# EAGLE design Papra v0.6 (EAGLE 9.6.2)
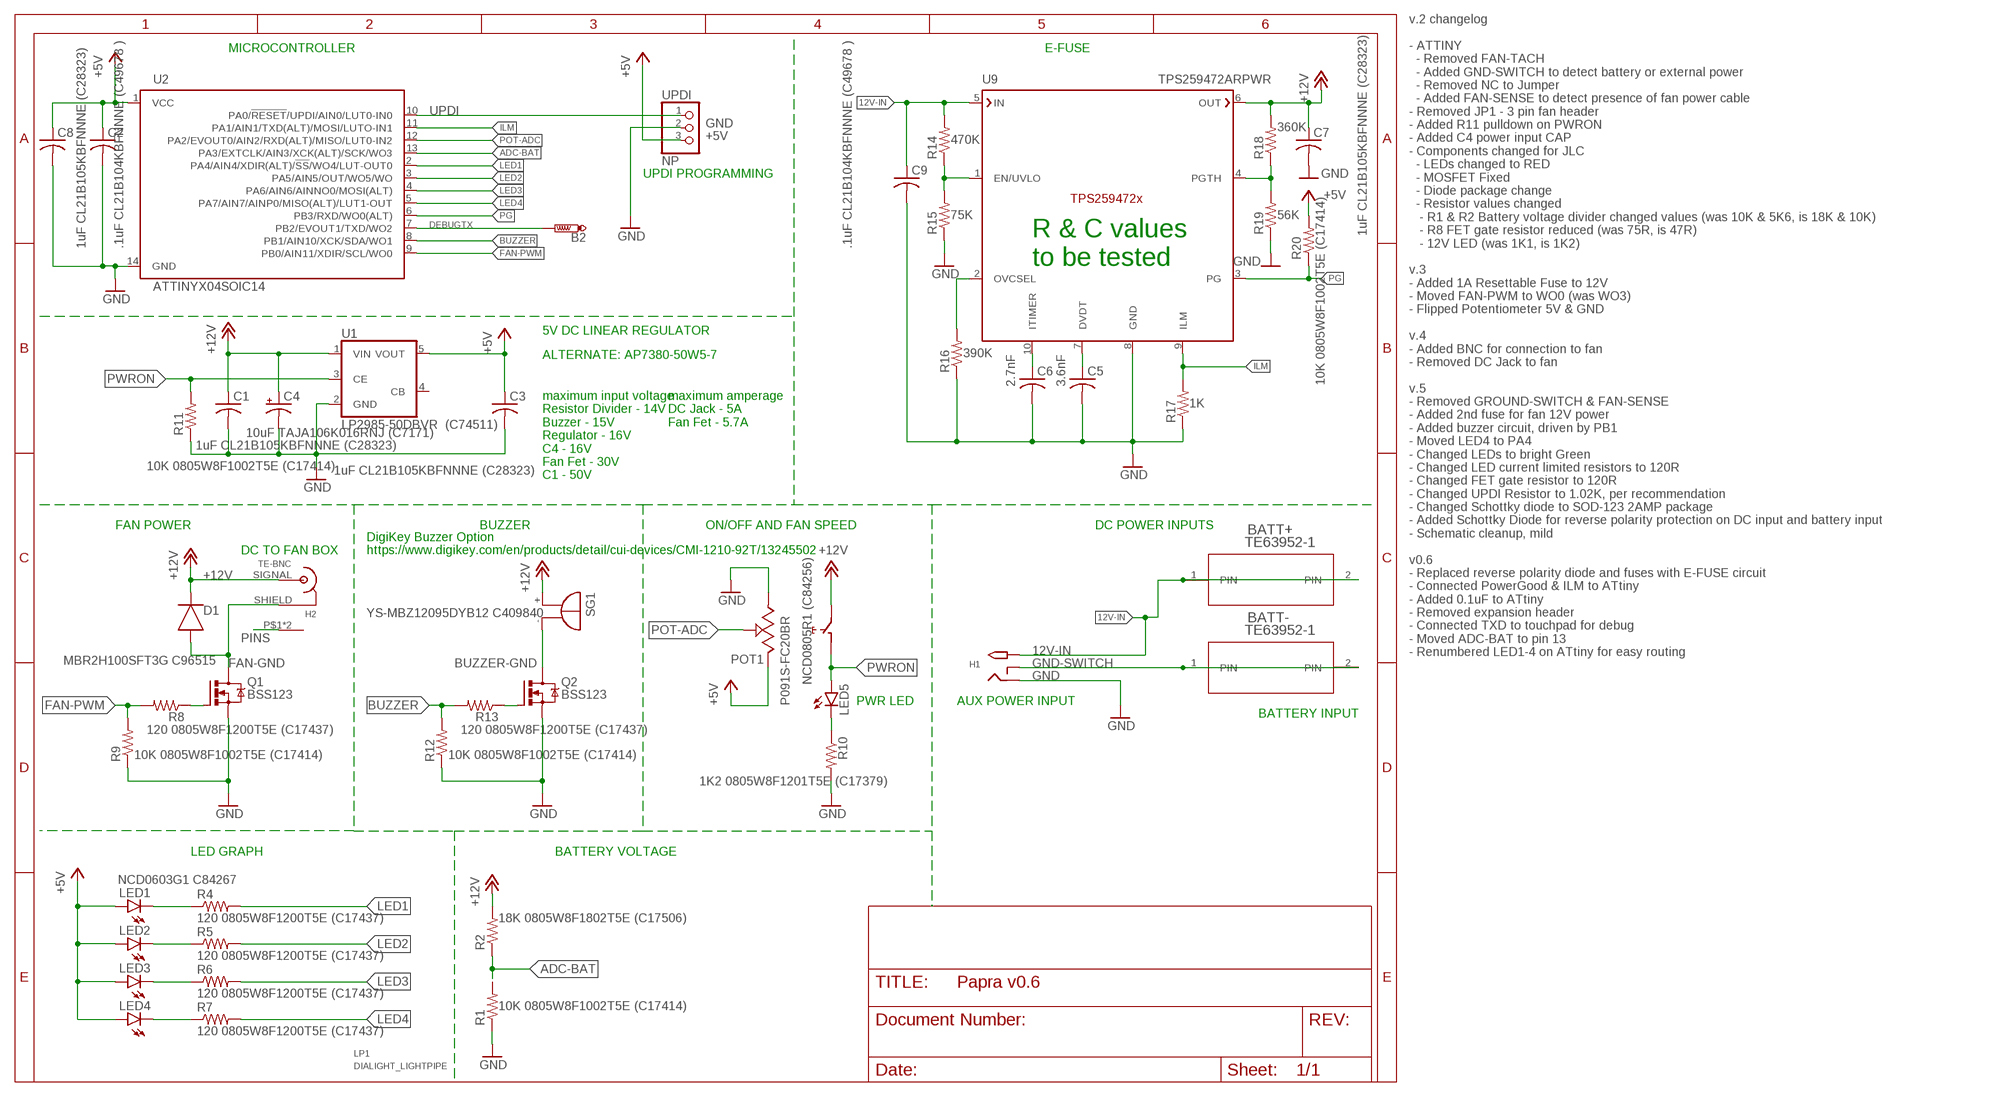
[diagram p0: schematic, sheet 1]

## Parts
B2  PTR1PAD1-13  [P1-13]
BATT+  TE63952-1  [TE63952-1]
BATT-  TE63952-1  [TE63952-1]
C1  1uF CL21B105KBFNNNE (C28323)  C-USC0805  [C0805]
C2  .1uF CL21B104KBFNNNE (C49678 )  C-USC0805  [C0805]
C3  1uF CL21B105KBFNNNE (C28323)  C-USC0805  [C0805]
C4  10uF TAJA106K016RNJ (C7171)  CPOL-USA/3216-18R  [A/3216-18R]
C5  3.6nF  C-USC0805  [C0805]
C6  2.7nF  C-USC0805  [C0805]
C7  1uF CL21B105KBFNNNE (C28323)  C-USC0805  [C0805]
C8  1uF CL21B105KBFNNNE (C28323)  C-USC0805  [C0805]
C9  .1uF CL21B104KBFNNNE (C49678 )  C-USC0805  [C0805]
D1  MBR2H100SFT3G C96515  DIODE_DO-219-AB(SOD123F)  [SODFL3718X115]
H1  M-CUI-PJ-066A  PJ-066A  [DCJACK-PJ-066A]
H2  TE-BNC  [TE-BNC]
LED1  NCD0603G1 C84267  LEDCHIPLED_0805  [CHIPLED_0805]
LED2  NCD0603G1 C84267  LEDCHIPLED_0805  [CHIPLED_0805]
LED3  NCD0603G1 C84267  LEDCHIPLED_0805  [CHIPLED_0805]
LED4  NCD0603G1 C84267  LEDCHIPLED_0805  [CHIPLED_0805]
LED5  NCD0805R1 (C84256)  LEDCHIPLED_0805  [CHIPLED_0805]
LP1  DIALIGHT_LIGHTPIPE  [DIALIGHT_5151020F_/LEDS]
POT1  P091S-FC20BR  [P091S-FC20BR]
Q1  BSS123  NMOSFET_BSS123-SOT23  [SOT23]
Q2  BSS123  NMOSFET_BSS123-SOT23  [SOT23]
R1  10K 0805W8F1002T5E (C17414)  R-US_R0805  [R0805]
R2  18K 0805W8F1802T5E (C17506)  R-US_R0805  [R0805]
R4  120 0805W8F1200T5E (C17437)  R-US_R0805  [R0805]
R5  120 0805W8F1200T5E (C17437)  R-US_R0805  [R0805]
R6  120 0805W8F1200T5E (C17437)  R-US_R0805  [R0805]
R7  120 0805W8F1200T5E (C17437)  R-US_R0805  [R0805]
R8  120 0805W8F1200T5E (C17437)  R-US_R0805  [R0805]
R9  10K 0805W8F1002T5E (C17414)  R-US_R0805  [R0805]
R10  1K2 0805W8F1201T5E (C17379)  R-US_R0805  [R0805]
R11  10K 0805W8F1002T5E (C17414)  R-US_R0805  [R0805]
R12  10K 0805W8F1002T5E (C17414)  R-US_R0805  [R0805]
R13  120 0805W8F1200T5E (C17437)  R-US_R0805  [R0805]
R14  470K  R-US_R0805  [R0805]
R15  75K  R-US_R0805  [R0805]
R16  390K  R-US_R0805  [R0805]
R17  1K  R-US_R0805  [R0805]
R18  360K  R-US_R0805  [R0805]
R19  56K  R-US_R0805  [R0805]
R20  10K 0805W8F1002T5E (C17414)  R-US_R0805  [R0805]
SG1  YS-MBZ12095DYB12 C409840  F/TMB  [F/TMB]
U1  LP2985-50DBVR (C74511)  TS520533  [SOT25]
U2  ATTINYX04SOIC14  [SOIC127P600X144-14]
U9  TPS259472ARPWR  [QFN45P200X200X100-16N]
UPDI  NP  PINHD-1X3  [1X03]

## Nets
12V-IN [RAIL]: BATT+.1(PIN) BATT+.2(PIN) C9.1 H1.PWR(TIP) R14.2 U9.5(IN)
+5V [RAIL]: C2.1 C3.1 C8.1 LED1.A LED2.A LED3.A LED4.A POT1.3 R20.2 U1.5(VOUT) U2.1(VCC) UPDI.3
+12V [RAIL]: C1.1 C4.+ C7.1 D1.1(C) H2.SIGNAL(P1) POT1.NO R2.2 R18.2 SG1.+ U1.1(VIN) U9.6(OUT)
ADC-BAT: R1.2 R2.1 U2.13(PA3/EXTCLK/AIN3/XCK(ALT)/SCK/WO3)
BUZZER: R12.2 R13.2 U2.8(PB1/AIN10/XCK/SDA/WO1)
BUZZER-GND [RAIL]: Q2.3(D) SG1.-
DEBUGTX: B2.TP U2.7(PB2/EVOUT1/TXD/WO2)
DVDT: C5.1 U9.7(DVDT)
EN/UVLO: R14.1 R15.2 U9.1(EN/UVLO)
FAN-GND [RAIL]: D1.2(A) H2.SHIELD(P2) Q1.3(D)
FAN-PWM: R8.2 R9.2 U2.9(PB0/AIN11/XDIR/SCL/WO0)
FETGATE: Q1.1(G) R8.1
FETGATE1: Q2.1(G) R13.1
GND: C1.2 C2.2 C3.2 C4.- C5.2 C6.2 C7.2 C8.2 C9.2 H1.GND(RING) POT1.1 Q1.2(S) Q2.2(S) R1.1 R9.1 R10.2 R11.1 R12.1 R15.1 R16.1 R17.1 R19.1 U1.2(GND) U2.14(GND) U9.8(GND) UPDI.2
GND-SWITCH: BATT-.1(PIN) BATT-.2(PIN) H1.GNDBREAK(RING_SW)
ILM: R17.2 U2.11(PA1/AIN1/TXD(ALT)/MOSI/LUTO-IN1) U9.9(ILM)
ITIMER: C6.1 U9.10(ITIMER)
LED1: R4.2 U2.2(PA4/AIN4/XDIR(ALT)/!SS!/WO4/LUT-OUT0)
LED1-R: LED1.C R4.1
LED2: R5.2 U2.3(PA5/AIN5/OUT/WO5/WO)
LED2-R: LED2.C R5.1
LED3: R6.2 U2.4(PA6/AIN6/AINNO0/MOSI(ALT))
LED3-R: LED3.C R6.1
LED4: R7.2 U2.5(PA7/AIN7/AINP0/MISO(ALT)/LUT1-OUT)
LED4-R: LED4.C R7.1
LED5-R: LED5.C R10.1
OVCSEL: R16.2 U9.2(OVCSEL)
PG: R20.1 U2.6(PB3/RXD/WO0(ALT)) U9.3(PG)
PGTH: R18.1 R19.2 U9.4(PGTH)
PINS: H2.P$1(P3) H2.P$2(P3)
POT-ADC: POT1.2 U2.12(PA2/EVOUT0/AIN2/RXD(ALT)/MISO/LUT0-IN2)
PWRON: LED5.A POT1.COM R11.2 U1.3(CE)
UPDI: U2.10(PA0/!RESET!/UPDI/AIN0/LUT0-IN0) UPDI.1
Unconnected: U1.4(CB)

## Notes on the sheet
- v.2 changelog
  
  - ATTINY 
    - Removed FAN-TACH
    - Added GND-SWITCH to detect battery or external power
    - Removed NC to Jumper
    - Added FAN-SENSE to detect presence of fan power cable
  - Removed JP1 - 3 pin fan header
  - Added R11 pulldown on PWRON
  - Added C4 power input CAP 
  - Components changed for JLC
    - LEDs changed to RED
    - MOSFET Fixed
    - Diode package change
    - Resistor values changed
     - R1 & R2 Battery voltage divider changed values (was 10K & 5K6, is 18K & 10K)
     - R8 FET gate resistor reduced (was 75R, is 47R)
     - 12V LED (was 1K1, is 1K2)
  
  v.3
  - Added 1A Resettable Fuse to 12V
  - Moved FAN-PWM to WO0 (was WO3)
  - Flipped Potentiometer 5V & GND
  
  v.4 
  - Added BNC for connection to fan
  - Removed DC Jack to fan
  
  v.5
  - Removed GROUND-SWITCH & FAN-SENSE
  - Added 2nd fuse for fan 12V power
  - Added buzzer circuit, driven by PB1
  - Moved LED4 to PA4
  - Changed LEDs to bright Green
  - Changed LED current limited resistors to 120R
  - Changed FET gate resistor to 120R
  - Changed UPDI Resistor to 1.02K, per recommendation
  - Changed Schottky diode to SOD-123 2AMP package
  - Added Schottky Diode for reverse polarity protection on DC input and battery input
  - Schematic cleanup, mild
  
  v0.6
  - Replaced reverse polarity diode and fuses with E-FUSE circuit
  - Connected PowerGood & ILM to ATtiny
  - Added 0.1uF to ATtiny
  - Removed expansion header
  - Connected TXD to touchpad for debug
  - Moved ADC-BAT to pin 13
  - Renumbered LED1-4 on ATtiny for easy routing
- MICROCONTROLLER | E-FUSE
- UPDI PROGRAMMING
- R & C values
  to be tested
- 5V DC LINEAR REGULATOR
- ALTERNATE: AP7380-50W5-7
- maximum input voltage
  Resistor Divider - 14V
  Buzzer - 15V
  Regulator - 16V
  C4 - 16V
  Fan Fet - 30V
  C1 - 50V
- maximum amperage
  DC Jack - 5A
  Fan Fet - 5.7A
- FAN POWER | BUZZER | ON/OFF AND FAN SPEED | DC POWER INPUTS
- DC TO FAN BOX
- DigiKey Buzzer Option
  https://www.digikey.com/en/products/detail/cui-devices/CMI-1210-92T/13245502
- PWR LED | AUX POWER INPUT
- BATTERY INPUT
- LED GRAPH | BATTERY VOLTAGE

## Library data of the parts
B2 = testpad:PTR1: TEST PIN
BATT+ BATT- = PC-LIB:TE63952-1
C1-C3 C5-C9 = rcl:C-US: CAPACITOR, American symbol; SPICEPREFIX: C
C4 = rcl:CPOL-US: POLARIZED CAPACITOR, American symbol; SPICEPREFIX: C
D1 = Diode:DIODE: Diode Rectifier - Generic; CATEGORY: Diode; SUB-CATEGORY: Rectifier; VALUE: DIODE
H1 = PC-LIB:PJ-066A
H2 = PC-LIB:TE-BNC: https://www.te.com/usa-en/product-1-1478032-0.html
LED1-LED5 = led:LED: LED OSRAM: - CHIPLED LG R971, LG N971, LY N971, LG Q971, LY Q971, LO R971, LY R971 LH N974, LH R974 LS Q976, LO Q976, LY Q976 LO Q996 - Hyper CHIPLED LW Q18S LB Q993, LB Q99A, LB R99A - SideLED LS A670, LO A670, LY A670, LG A670, LP A670 LB A673, LV A673, LT A673, LW A673 LH A674 LY A675 LS A676, LA A676, LO A676, LY A676, LW A676 LS A679, LY A679, LG A679 - Hyper Micro SIDELED® LS Y876, LA Y876, LO Y876, LY Y876 LT Y87S - SmartLED LW L88C, LW L88S LB L89C, LB L89S, LG L890 LS L89K, LO L89K, LY L89K LS L896, LA L896, LO L896, LY L896 - TOPLED LS T670, LO T670, LY T670, LG T670, LP T670 LSG T670, LSP T670, LSY T670, LOP T670, LYG T670 LG T671, LOG T671, LSG T671 LB T673, LV T673, LT T673, LW T673 LH T674 LS T676, LA T676, LO T676, LY T676, LB T676, LH T676, LSB T676, LW T676 LB T67C, LV T67C, LT T67C, LS T67K, LO T67K, LY T67K, LW E67C LS E67B, LA E67B, LO E67B, LY E67B, LB E67C, LV E67C, LT E67C LW T67C LS T679, LY T679, LG T679 LS T770, LO T770, LY T770, LG T770, LP T770 LB T773, LV T773, LT T773, LW T773 LH T774 LS E675, LA E675, LY E675, LS T675 LS T776, LA T776, LO T776, LY T776, LB T776 LHGB T686 LT T68C, LB T68C - Hyper Mini TOPLED® LB M676 - Mini TOPLED Santana® LG M470 LS M47K, LO M47K, LY M47K Source: http://www.osram.convergy.de LUXEON: - LUMILED® LXK2-PW12-R00, LXK2-PW12-S00, LXK2-PW14-U00, LXK2-PW14-V00 LXK2-PM12-R00, LXK2-PM12-S00, LXK2-PM14-U00 LXK2-PE12-Q00, LXK2-PE12-R00, LXK2-PE12-S00, LXK2-PE14-T00, LXK2-PE14-U00 LXK2-PB12-K00, LXK2-PB12-L00, LXK2-PB12-M00, LXK2-PB14-N00, LXK2-PB14-P00, LXK2-PB14-Q00 LXK2-PR12-L00, LXK2-PR12-M00, LXK2-PR14-Q00, LXK2-PR14-R00 LXK2-PD12-Q00, LXK2-PD12-R00, LXK2-PD12-S00 LXK2-PH12-R00, LXK2-PH12-S00 LXK2-PL12-P00, LXK2-PL12-Q00, LXK2-PL12-R00 Source: www.luxeon.com KINGBRIGHT: KA-3528ASYC Source: www.kingbright.com
LP1 = PC-LIB:DIALIGHT_LIGHTPIPE: DIALIGHT QUAD LIGHTPIPE 515-1020 WITH 0805LEDS
POT1 = PC-LIB:P091S-FC20BR: TT P091S-FC20BR10K
Q1 Q2 = Transistor:NMOSFET_: N-Channel MOSFET - Popular parts; CATEGORY: Transistor; DESCRIPTION: MOSFET N-CH 100V 0.17A SOT-23; DRAIN_CURRENT: 170mA; MANUFACTURER: ON Semiconductor; MPN: BSS123L; OPERATING_TEMP: -55°C ~ 150°C; PART_STATUS: Active; ROHS_COMPLIANT: Yes; SUB-CATEGORY: MOSFET; THERMALLOSS: 360mW; TYPE: N-Channel
R1 R2 R4-R20 = rcl:R-US_: RESISTOR, American symbol; SPICEPREFIX: R
SG1 = buzzer:F/TMB: BUZZER Source: Buerklin; OC_FARNELL: unknown; OC_NEWARK: unknown
U1 = v-reg:TS5205: 150mA Low Noise LDO Voltage Regulator with Enable TSC [Taiwan Semiconductor Company, Ltd] Source: http://www.taiwansemi.com .. 5205_0409c.pdf
U2 = PC-LIB:ATTINYX04
U9 = TI e-Fuse:TPS259472ARPWR
UPDI = adafruit:PINHD-1X3: PIN HEADER

## Net classes
0 default: width 0.152 mm, clearance 0.152 mm
1 RAIL: width 0.229 mm, clearance 0.152 mm

## Board
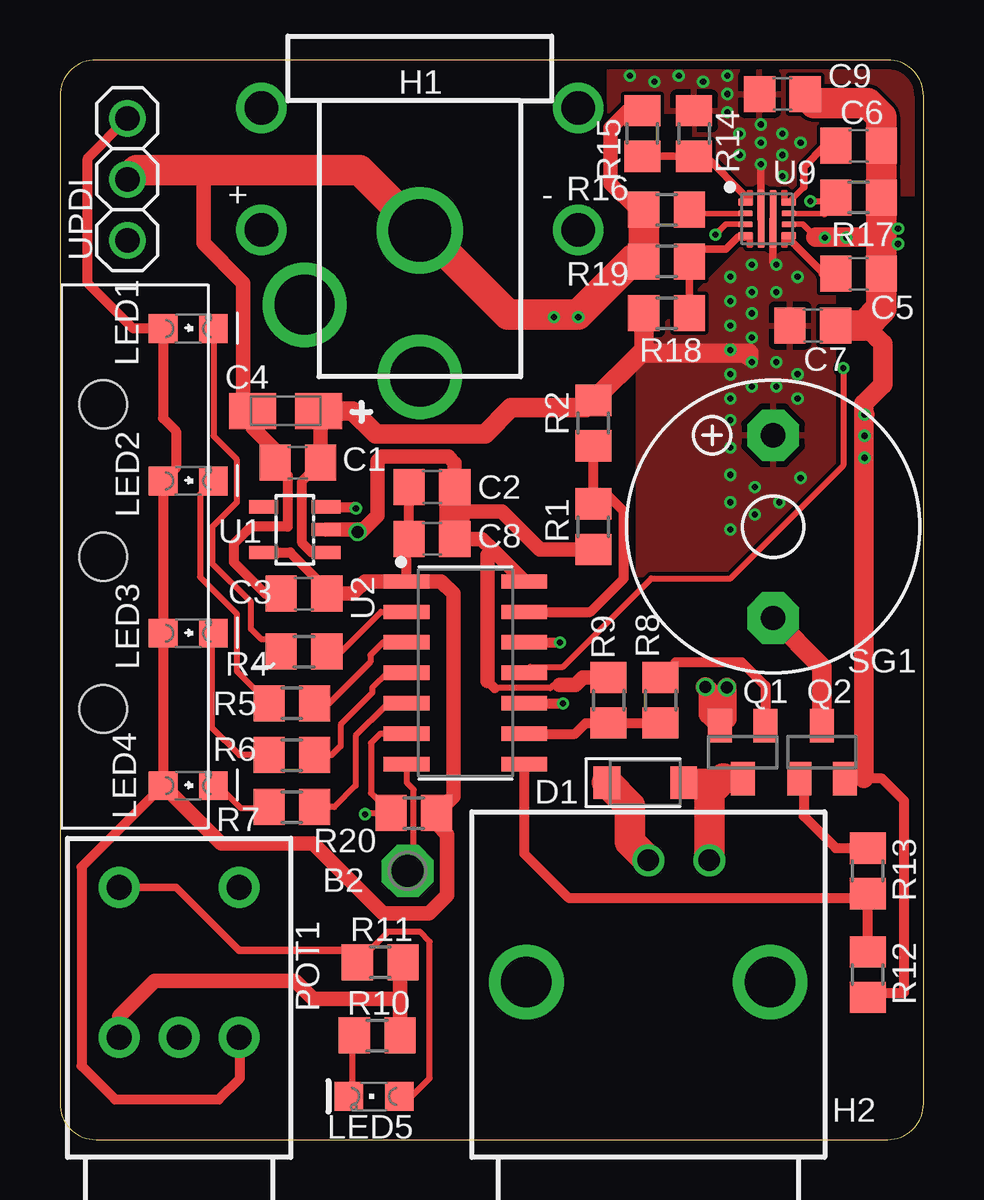
[diagram p1: board, top side]
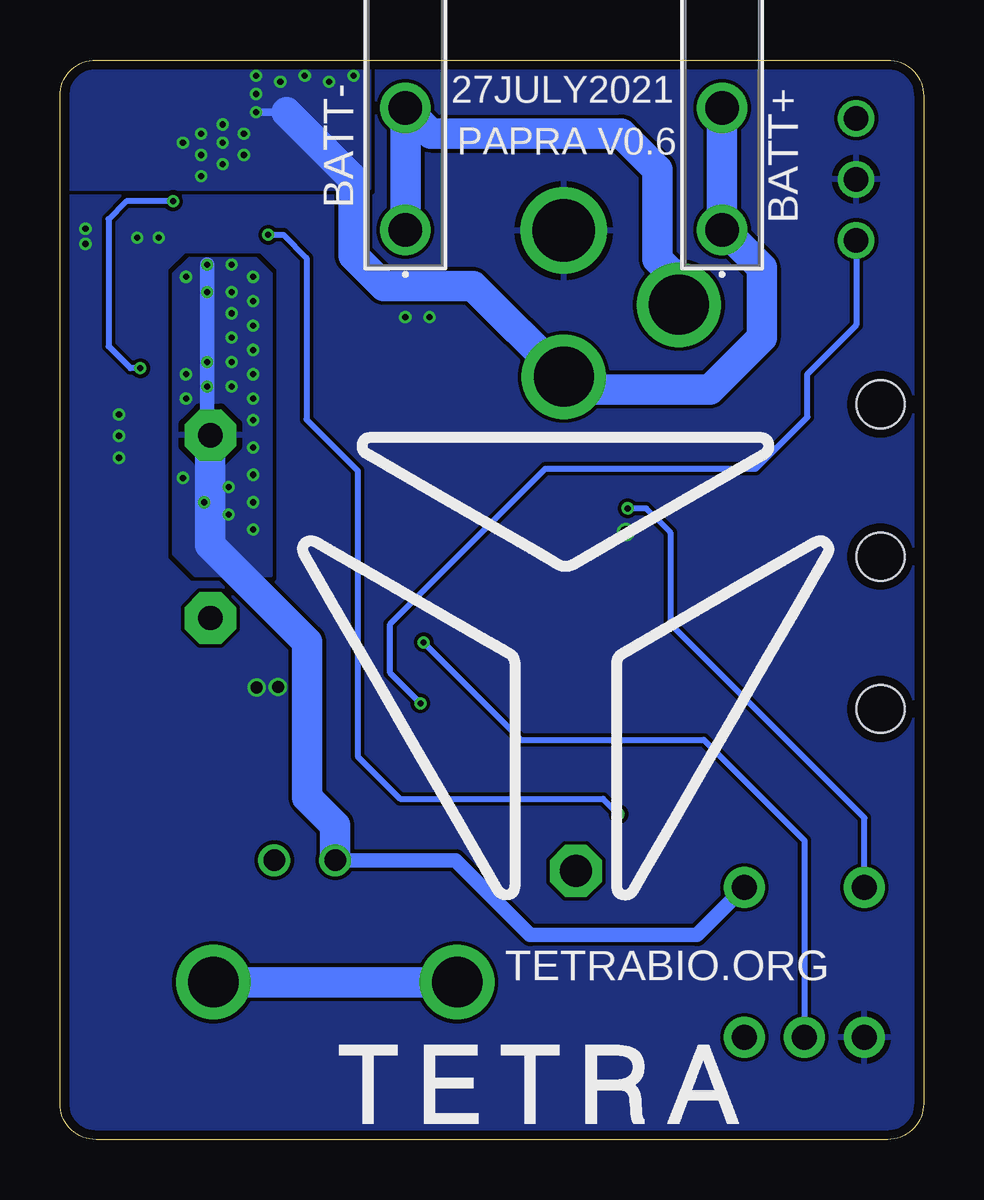
[diagram p2: board, bottom side, seen from below]

Size 36 x 45 mm. Coordinates in mm from the lower left corner, seen from the top.
Outline: 34.5,45 1.5,45 arc90 0,43.5 0,1.5 arc90 1.5,0 34.5,0 arc90 36,1.5 36,43.5 arc90 34.5,45
Copper layers (1*16): Top 0.035559375mm / dielectric 1.6mm / Bottom 0.035559375mm
Design rules "oshpark-2layer": minimum track width 6mil, minimum drill 10mil, track to track 6mil, track to pad 6mil, pad to pad 6mil, via to via 6mil, smd to smd 6mil, copper to edge 15mil, drill to drill 6mil, minimum pad ring 5mil, minimum via ring 5mil, stop-mask expansion 2.5mil, vias tented up to drill 0mil, thermal gap 10mil

### Footprints (pad centres in the part's own frame; a part is rotated, then mirrored left to right if it is on the bottom)
P1-13 = drill 1.321 pad 2.159 octagon: TP 0,0
TE63952-1 = drill 1.397 pad 1.905: 1 -2.54,0; 2 2.54,0
C0805 = smd 1.3 x 1.5: 1 -0.95,0; 2 0.95,0
A/3216-18R = smd 1.95 x 1.5: + 1.375,0; - -1.375,0
SODFL3718X115 = smd 1.115 x 1.361: 1 -1.6,0; 2 1.6,0
DCJACK-PJ-066A = drill 2.6: GND 0,8.1 | drill 2.5: GNDBREAK 4.8,11.2; PWR 0,14.2
TE-BNC = drill 2.1: P$1 -7.3,5.08; P$2 -7.3,-5.08 | drill 0.89: SHIELD -12.38,2.54; SIGNAL -12.38,0
CHIPLED_0805 = smd 1.2 x 1.2: A 0,-1.05; C 0,1.05
DIALIGHT_5151020F_/LEDS = hole 2: 0,0; 6.35,0; -6.35,0
P091S-FC20BR = drill 1.05 pad 1.7: 1 -5,-2.5; 2 -5,0; 3 -5,2.5; COM -11.25,-2.5; NO -11.25,2.5
SOT23 = smd 1 x 1.4: 1 -0.95,-1.1; 2 0.95,-1.1; 3 0,1.1
R0805 = smd 1.3 x 1.5: 1 -0.95,0; 2 0.95,0
F/TMB = drill 1.016 pad 2.159 octagon: + 3.81,0; - -3.81,0
SOT25 = smd 0.55 x 1.2: 1 -0.95,-1.3; 2 0,-1.3; 3 0.95,-1.3; 4 0.95,1.3; 5 -0.95,1.3
SOIC127P600X144-14 = smd 1.901 x 0.599: 1 -2.455,3.81; 2 -2.455,2.54; 3 -2.455,1.27; 4 -2.455,0; 5 -2.455,-1.27; 6 -2.455,-2.54; 7 -2.455,-3.81; 8 2.455,-3.81; 9 2.455,-2.54; 10 2.455,-1.27; 11 2.455,0; 12 2.455,1.27; 13 2.455,2.54; 14 2.455,3.81
QFN45P200X200X100-16N = smd 0.6 x 0.3: 1 -0.9,0.7; 4 -0.9,-0.7; 7 0.9,-0.7; 10 0.9,0.7 | smd 0.6 x 0.25: 2 -0.9,0.225; 3 -0.9,-0.225; 8 0.9,-0.225; 9 0.9,0.225 | smd 0.3 x 2.4: 5 -0.25,0; 6 0.25,0
1X03 = drill 1.016: 1 -2.54,0; 2 0,0; 3 2.54,0

### Placement (x,y rotation side)
B2  14.49,11.2 0 top
BATT+  8.4,40.46 90 bottom
BATT-  21.6,40.46 90 bottom
C1  9.92,28.21 180 top
C2  15.51,27.2 0 top
C3  10.17,22.75 180 top
C4  9.41,30.37 0 top
C5  33.29,36.09 0 top
C6  33.29,41.42 0 top
C7  31.38,33.93 0 top
C8  15.51,25.04 0 top
C9  30.11,43.58 0 top
D1  24.4,14.88 0 top
H1  15,46 180 top
H2  24.52,-0.74 270 top
LED1  5.35,33.8 270 top
LED2  5.35,27.45 270 top
LED3  5.35,21.1 270 top
LED4  5.35,14.75 270 top
LED5  13.1,1.8 90 top
LP1  1.8,24.3 270 top
POT1  4.97,-0.74 270 top
Q1  28.46,16.15 180 top
Q2  31.76,16.15 0 top
R1  22.24,25.55 90 top
R2  22.24,29.87 90 top
R4  10.17,20.34 0 top
R5  9.67,18.18 0 top
R6  9.67,16.02 0 top
R7  9.67,13.86 0 top
R8  25.03,18.31 270 top
R9  22.87,18.31 270 top
R10  13.22,4.34 0 top
R11  13.35,7.39 180 top
R12  33.67,6.88 90 top
R13  33.67,11.2 270 top
R14  26.43,41.93 90 top
R15  24.27,41.93 270 top
R16  25.29,38.76 0 top
R17  33.29,39.26 180 top
R18  25.29,34.44 180 top
R19  25.29,36.6 0 top
R20  14.75,13.61 0 top
SG1  29.73,25.55 90 top
U1  9.79,25.42 90 top
U2  16.91,19.45 0 top
U9  29.48,38.38 0 top
UPDI  2.81,40.03 90 top

### Tracks (layer width: path | path; a pad name or v marks a point on that pad's centre or on a via)
12V-IN  (via drill 0.25)
  Top 0.229: v29.23,40.66 v29.22,40.66
  Top 0.305: U9.5 v29.23,40.66
  Bottom 0.305: 26.56,42.82 v27.83,42.82
  Bottom 1.27: BATT+.2 BATT+.1 8.32,37.92 6.74,36.34 6.74,33.42 8.9,31.26 15,31.26 H1.PWR 18.79,35.58 22.49,35.58 23.76,36.85 23.76,40.03 26.56,42.82
  other vias: 29.22,41.55 29.22,42.31 28.34,41.04 30.11,41.04 30.11,41.93 28.34,41.93 30.88,41.55 30.11,40.15 27.83,43.58 27.83,44.34 26.81,44.09 25.8,44.34 24.78,44.09 23.76,44.34
  pour Bottom (isolate 0.203, rank 2): 23.13,39.64 36.46,39.64 36.46,45.23 23.13,45.23
  pour Top (isolate 0.152): 22.87,45.23 36.34,45.23 36.34,39.39 26.43,39.39 26.43,42.82 22.87,42.82
+5V
  Top 0.406: U1.5 9.6,24.47 11.12,22.95 C3.1 | U2.1 14.45,24.93 C8.1 C2.1 | POT1.3 7.51,4.22 7.51,2.56 6.62,1.67 2.3,1.67 0.9,3.07 0.9,11.36 LED4.A LED3.A LED2.A 4.84,28 4.84,29.53 4.3,30.07 LED1.A 3.06,33.8 1.16,35.71 1.16,40.91 UPDI.3
  Top 0.61: C3.1 12.21,22.75 12.71,23.26 U2.1 15.89,23.26 16.4,22.75 16.4,14.31 R20.2 15.7,13.17 16.14,12.72 16.14,10.18 15.38,9.42 13.48,9.42 10.55,12.34 6.71,12.34 LED4.A
+12V  (via drill 0.25)
  Top 0.229: 29.73,36.6 v29.86,36.47
  Top 0.305: U9.6 29.73,36.6
  Top 0.406: U1.1 10.49,24.47 10.1,24.86 10.1,27.44 C1.1
  Top 0.61: C4.+ 10.87,30.29 C1.1
  Top 0.813: 24.21,32.79 R2.2 21.92,30.5 18.81,30.5 17.72,29.41 13.17,29.41 12.21,30.37 C4.+ | 24.21,32.79 24.34,32.91 R18.2 | 24.21,32.79 28.72,32.79 28.72,32.66
  Top 1.27: H2.SIGNAL 23.76,12.4 23.76,13.91 D1.1
  Bottom 0.61: POT1.NO 9.45,8.53 16.4,8.53 19.51,11.64 H2.SIGNAL | v29.86,36.47 v29.86,35.33 v29.86,32.41 29.86,29.48 SG1.+
  Bottom 1.27: SG1.+ 29.73,24.79 25.69,20.75 25.69,14.27 24.52,13.1 H2.SIGNAL
  other vias: 28.84,36.47 28.84,35.33 28.84,34.44 28.84,33.42 28.84,32.41 28.84,31.39 27.95,31.9 27.95,32.91 27.95,33.93 27.95,34.95 27.95,35.96 30.75,35.96 27.95,30.88 29.86,31.39 30.75,31.9 30.75,30.88 27.95,29.99 27.95,28.85 27.95,27.71 27.95,26.56 27.95,25.42 28.97,26.06 28.97,27.2 29.99,26.56 30.88,27.58
  pour Top (isolate 0.152): 28.34,37.11 30.49,37.11 32.27,35.33 32.27,23.52 24.07,23.52 24.07,32.84
  pour Bottom (isolate 0.152): 27.19,23.52 30.37,23.52 31.26,24.41 31.26,36.09 30.62,36.72 27.83,36.72 27.19,36.09
ADC-BAT
  Top 0.406: R1.2 22.24,26.82 | 22.24,26.82 R2.1 | U2.13 22.11,21.99 23.51,23.39 23.51,26.18 22.87,26.82 22.24,26.82
BUZZER
  Top 0.406: R12.2 R13.2 33.48,10.05 21.22,10.05 19.36,11.92 U2.8
BUZZER-GND
  Top 0.813: SG1.- 31.76,19.71 Q2.3
DEBUGTX
  Top 0.254: U2.7 14.45,14.88 14.75,14.58 14.75,12.21 14.49,11.96 B2.TP
DVDT
  Top 0.254: U9.7 30.38,37.55
  Top 0.305: 31.84,36.09 30.38,37.55
  Top 0.406: 31.84,36.09 C5.1
EN/UVLO
  Top 0.254: U9.1 28.58,39.33
  Top 0.305: 28.58,39.33 26.93,40.98 R14.1 R15.2
FAN-GND
  Top 0.813: D1.2 26.17,15.05 27.65,15.05 Q1.3
  Top 1.27: H2.SHIELD 27.06,14.47 27.65,15.05
FAN-PWM
  Top 0.406: U2.9 21.48,16.91 21.92,17.36 R9.2 R8.2
FETGATE
  Top 0.406: R8.1 25.67,19.89 28.43,19.89 29.41,18.91 Q1.1
FETGATE1
  Top 0.254: Q2.1 31,14.86
  Top 0.406: 31,14.86 31,13.48 32.34,12.15 R13.1
GND  (via drill 0.25, 0.51)
  Top 0.229: U9.8 30.97,38.15
  Top 0.254: 30.97,38.15 31.51,37.61 | 20.82,18.94 20.57,18.94 20.45,18.82 18.12,18.82
  Top 0.305: C1.2 9.5,27.69
  Top 0.406: R12.1 33.86,6.12 35.19,6.12 35.19,14.12 34.26,15.05 33.52,15.05 Q2.2 | C3.2 8.56,22.75 7.25,24.06 7.25,24.84 7.96,25.55 9.5,25.55 9.5,27.69 | 18.12,18.82 17.82,19.12
  Top 0.61: C4.- 8.04,29.68 8.97,28.75 C1.2 | R10.2 14.17,5.86 | 14.17,5.86 14.17,7.26 R11.1 | POT1.1 2.47,5.14 3.95,6.62 9.79,6.62 10.55,5.86 14.17,5.86 | R1.1 20.01,24.6 18.43,26.18 16.46,26.18 | U2.14 18.04,24.58 | 18.04,24.58 17.58,25.04 C8.2 | R15.1 23.68,42.88 22.95,42.16 22.95,39.84 24.04,38.76 R16.1 | U1.2 12.66,25.42 | 12.66,25.42 13.25,26 13.25,28.29 13.43,28.47 16.19,28.47 16.46,28.2 C2.2 | R9.1 21.8,19.26 21.49,18.94 20.82,18.94 | 17.82,19.12 17.82,24.35 18.04,24.58 | 12.66,25.42 12.56,25.32 v12.41,25.32 | 7.76,30.65 C4.- | C4.- 7.63,30.78 7.63,35.71 5.98,37.36 5.98,40.41
  Top 0.813: 31.51,37.61 34.24,37.61 | v26.91,18.87 27.04,18.74 27.04,17.72 Q1.2 27.8,17.54 v27.8,18.84 | 33.52,15.05 33.52,30.25 | 33.54,33.93 34.3,33.17 34.3,31.47 33.52,30.68 33.52,30.25 | v33.54,30.22 33.52,30.25
  Top 1.27: C9.2 31.44,43.2 33.67,43.2 34.24,42.63 C6.2 R17.1 34.24,37.61 C5.2 34.24,34.63 33.54,33.93 C7.2 | R16.1 R19.1 24.23,36.7 23.91,36.7 21.6,34.39 18.68,34.39 15.18,37.89 H1.GND 12.49,40.41 5.98,40.41 3.19,40.41 UPDI.2 | C8.2 16.46,26.18 C2.2
  other vias: 33.54,29.33 33.54,28.42 31.89,37.59 32.78,37.59 20.59,34.29 21.6,34.29 34.94,37.97 34.94,37.33
  pour Bottom (isolate 0.152, rank 3): 37.35,46.5 -1,46.5 -1,-1.5 37.35,-1.5
GND-SWITCH
  Bottom 1.27: BATT-.1 BATT-.2 20.53,41.93 12.59,41.93 11.09,40.43 11.09,36.7 10.2,35.82 H1.GNDBREAK
ILM  (via drill 0.25)
  Top 0.229: U9.9 31.87,38.6
  Top 0.254: U2.11 19.61,19.71 20.97,19.71 24.65,23.39 27.95,23.39 32.65,28.09 v32.65,32.15 | v31.28,39.11 32.19,39.11 R17.2
  Top 0.305: 31.87,38.6 32.34,39.08 R17.2
  Bottom 0.254: v31.28,39.11 33.24,39.11 33.97,38.38 33.97,33.07 33.06,32.15 v32.65,32.15
ITIMER
  Top 0.229: U9.10 31,39.7
  Top 0.305: 31,39.7 31,40.53 31.89,41.42 C6.1
LED1
  Top 0.254: R4.2 11.73,20.34 13.38,21.99 U2.2
LED1-R
  Top 0.254: R4.1 8.72,20.85 8.4,20.85 7.96,21.28 7.96,22.4 6.36,24 6.36,25.55 7.38,26.56 7.38,28.34 6.4,29.32 LED1.C
LED2
  Top 0.254: U2.3 13.48,20.72 12.94,20.19 12.94,19.91 11.21,18.18 R5.2
LED2-R
  Top 0.254: R5.1 7.38,19.52 7.38,21.92 5.84,23.45 5.84,26.9 LED2.C
LED3
  Top 0.254: U2.4 13.63,19.45 13.02,18.84 13.02,18.62 11.7,17.3 11.7,16.4 11.32,16.02 R6.2
LED3-R
  Top 0.254: R6.1 7.48,16.02 6.34,17.17 6.34,21.04 LED3.C
LED4
  Top 0.254: U2.5 14.32,18.05 13.55,18.05 12.33,16.84 12.33,14.75 11.44,13.86 R7.2
LED4-R
  Top 0.254: LED4.C 6.59,14.75 7.53,13.81 8.66,13.81 R7.1
LED5-R
  Top 0.254: R10.1 12.17,4.24 12.17,1.93 LED5.C
OVCSEL
  Top 0.229: U9.2 26.39,38.6
  Top 0.305: 26.39,38.6 R16.2
PG  (via drill 0.25)
  Top 0.229: U9.3 27.75,38.15
  Top 0.254: U2.6 13.35,16.91 12.97,16.53 12.97,14.44 R20.1 12.77,13.61 v12.71,13.56 | 27.75,38.15 v27.32,37.72
  Bottom 0.254: v27.32,37.72 26.68,37.72 25.72,36.75 25.72,30.02 23.59,27.88 23.59,15.97 21.82,14.2 13.36,14.2 v12.71,13.56
PGTH
  Top 0.203: U9.4 28.53,37.62
  Top 0.305: 28.53,37.62 28.27,37.62 27.75,37.11 26.74,37.11 R19.2 R18.1
PINS
  Bottom 1.27: H2.P$2 H2.P$1
POT-ADC  (via drill 0.25)
  Top 0.406: U2.12 v20.84,20.72
  Bottom 0.254: v20.84,20.72 16.78,16.66 9.16,16.66 4.97,12.47 POT1.2
PWRON  (via drill 0.25)
  Top 0.254: LED5.A 14.65,1.8 15.41,2.56 15.41,8.24 15,8.66 13.67,8.66 R11.2
  Top 0.305: POT1.COM 4.85,10.51 7.47,7.89 11.89,7.89 R11.2
  Top 0.406: U1.3 12.27,26.37 v12.33,26.31
  Bottom 0.254: POT1.COM 2.47,13.4 10.55,21.48 10.55,25.29 11.57,26.31 v12.33,26.31
UPDI  (via drill 0.25)
  Top 0.406: U2.10 v20.97,18.18
  Bottom 0.254: v20.97,18.18 22.24,19.45 22.24,21.48 15.76,27.96 7,27.96 4.84,30.12 4.84,31.92 2.81,33.95 UPDI.1

### Text on the board
bPlace: 27JULY2021 | PAPRA V0.6 | TETRABIO.ORG
tNames: + | -
Document: v.2 changelog / / - BATTERY Tabs swapped (polarity, same position) / - SMT Components Moved, won't affect mechanical / - D1 package changed (was SMB, is SMA) / / v.3 changelog (see schematic for signal changes) / / - Added mounting hole / - Added fuse, moved SMT components to fit / - Adjustments for JLC DRU, pad override was 40%, reduced to 25% / - Silk cleanup / - Changed Battery Tab package to round pads (was square) / / v.4 / - Board is 2mm wider on right side / - DC power out is now BNC / / v.5 / - Added buzzer / / v.6 / - See schematic changes
200bmp: C:/Users/pc/Downloads/Tetra Logo Package/tetra.bmp